# EAGLE design Bare Bones Arduino (EAGLE 6.5.0)
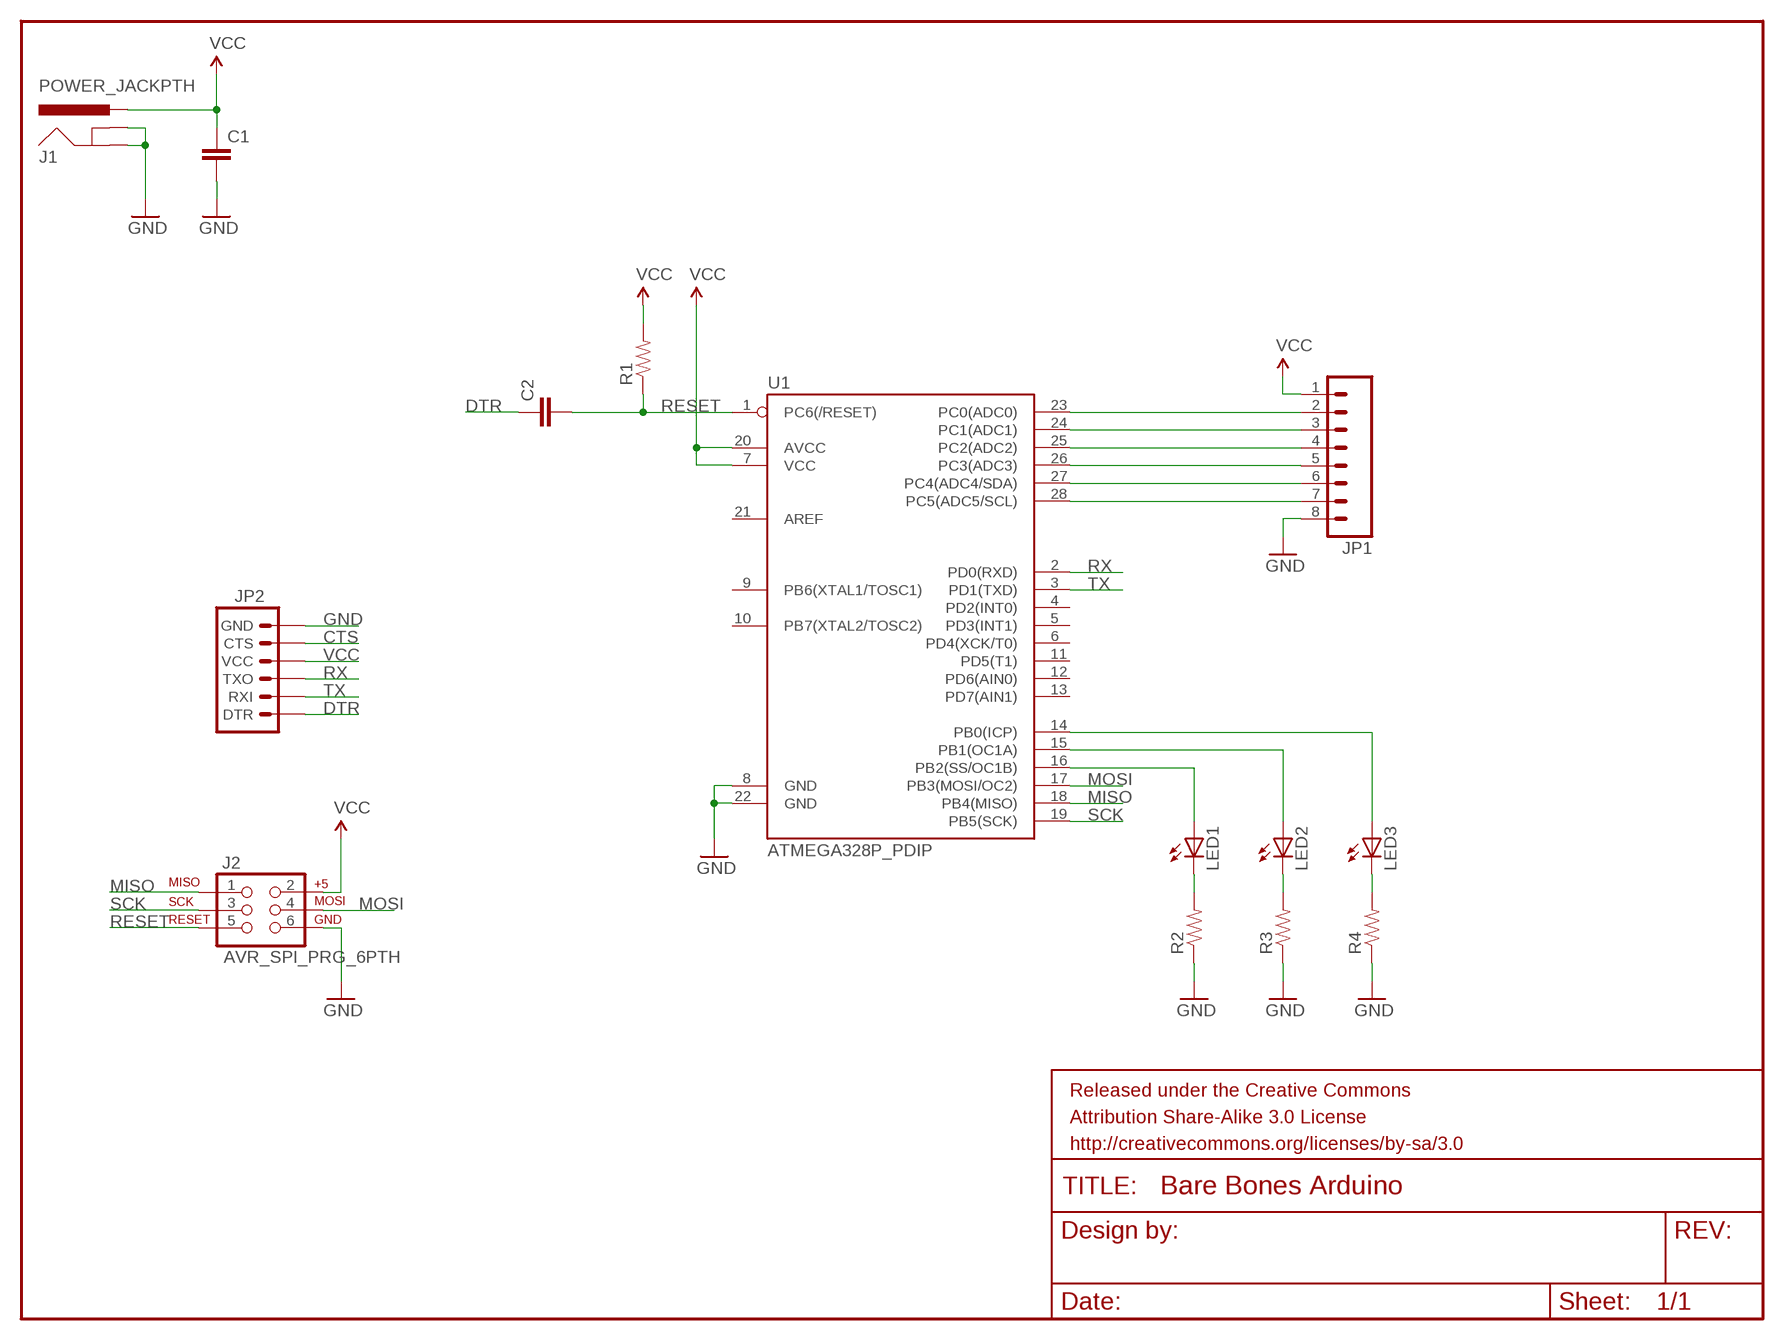
[diagram p0: schematic, sheet 1]

## Parts
C1  CAPPTH  [CAP-PTH-SMALL]
C2  CAPPTH  [CAP-PTH-SMALL]
FRAME1  FRAME-LETTER  [CREATIVE_COMMONS]
J1  POWER_JACKPTH  [POWER_JACK_PTH]
J2  AVR_SPI_PRG_6PTH  [2X3]
JP1  M081X08  [1X08]
JP2  ARDUINO_SERIAL_PROGRAMPTH  [1X06]
LED1  LED5MM  [LED5MM]
LED2  LED5MM  [LED5MM]
LED3  LED5MM  [LED5MM]
R1  RESISTORPTH-1/4W  [AXIAL-0.4]
R2  RESISTORPTH-1/4W  [AXIAL-0.4]
R3  RESISTORPTH-1/4W  [AXIAL-0.4]
R4  RESISTORPTH-1/4W  [AXIAL-0.4]
U1  ATMEGA328P_PDIP  [DIL28-3]

## Nets
CTS: JP2.5(CTS)
DTR: C2.1 JP2.1(DTR)
GND: C1.2 J1.GND J1.GNDBREAK J2.6 JP1.8 JP2.6(GND) R2.P$1 R3.P$1 R4.P$1 U1.8(GND) U1.22(GND)
MISO: J2.1 U1.18(PB4(MISO))
MOSI: J2.4 U1.17(PB3(MOSI/OC2))
N$1: LED1.A U1.16(PB2(SS/OC1B))
N$2: LED2.A U1.15(PB1(OC1A))
N$3: LED3.A U1.14(PB0(ICP))
N$4: LED1.K(C) R2.P$2
N$5: LED2.K(C) R3.P$2
N$6: LED3.K(C) R4.P$2
N$7: JP1.2 U1.23(PC0(ADC0))
N$8: JP1.3 U1.24(PC1(ADC1))
N$9: JP1.4 U1.25(PC2(ADC2))
N$10: JP1.5 U1.26(PC3(ADC3))
N$11: JP1.6 U1.27(PC4(ADC4/SDA))
N$12: JP1.7 U1.28(PC5(ADC5/SCL))
RESET: C2.2 J2.5 R1.P$1 U1.1(PC6(/RESET))
RX: JP2.3(TXO) U1.2(PD0(RXD))
SCK: J2.3 U1.19(PB5(SCK))
TX: JP2.2(RXI) U1.3(PD1(TXD))
VCC: C1.1 J1.PWR J2.2 JP1.1 JP2.4(VCC) R1.P$2 U1.7(VCC) U1.20(AVCC)
Unconnected: U1.4(PD2(INT0)) U1.5(PD3(INT1)) U1.6(PD4(XCK/T0)) U1.9(PB6(XTAL1/TOSC1)) U1.10(PB7(XTAL2/TOSC2)) U1.11(PD5(T1)) U1.12(PD6(AIN0)) U1.13(PD7(AIN1)) U1.21(AREF)

## Library data of the parts
C1 C2 = SparkFun-Capacitors:CAP: Capacitor Standard 0603 ceramic capacitor, and 0.1" leaded capacitor.
FRAME1 = SparkFun-Aesthetics:FRAME-LETTER: Schematic Frame Standard 8.5x11 US Letter frame
J1 = SparkFun-Connectors:POWER_JACK: Power Jack This is the standard 5.5mm barrel jack for power. The PTH is the most common, proven, reliable, footprint. The Slot footprint only works if the mill layer is transmitted to the PCB fab house so be warned. Spark Fun Electronics SKU : PRT-00119 SMT: CONN-08106 Mating wall wart : TOL-00298 (and others)
J2 = SparkFun-Connectors:AVR_SPI_PRG_6: AVR ISP 6 Pin This is the reduced ISP connector for AVR programming. Common on Arduino. This footprint will take up less PCB space and can be used with a 10-pin to 6-pin adapter such as SKU: BOB-08508
JP1 = SparkFun-Connectors:M08: Header 8 Standard 8-pin 0.1" header. Use with straight break away headers (SKU : PRT-00116), right angle break away headers (PRT-00553), swiss pins (PRT-00743), machine pins (PRT-00117), and female headers (PRT-00115).
JP2 = SparkFun-Connectors:ARDUINO_SERIAL_PROGRAM: FTDI connector footprints
LED1-LED3 = SparkFun-LED:LED: LEDs Standard schematic elements and footprints for 5mm, 3mm, 1206, and 0603 sized LEDs. 5mm - Spark Fun Electronics SKU : COM-00529 (and others)
R1-R4 = SparkFun-Resistors:RESISTOR: Resistor Basic schematic elements and footprints for 0603, 1206, and PTH resistors.
U1 = SparkFun-DigitalIC:ATMEGA328P_PDIP: uC used in the Arduino 32kb flash, 1k EEPROM, 2k SRAM This is the through-hole version of this chip.

## Board
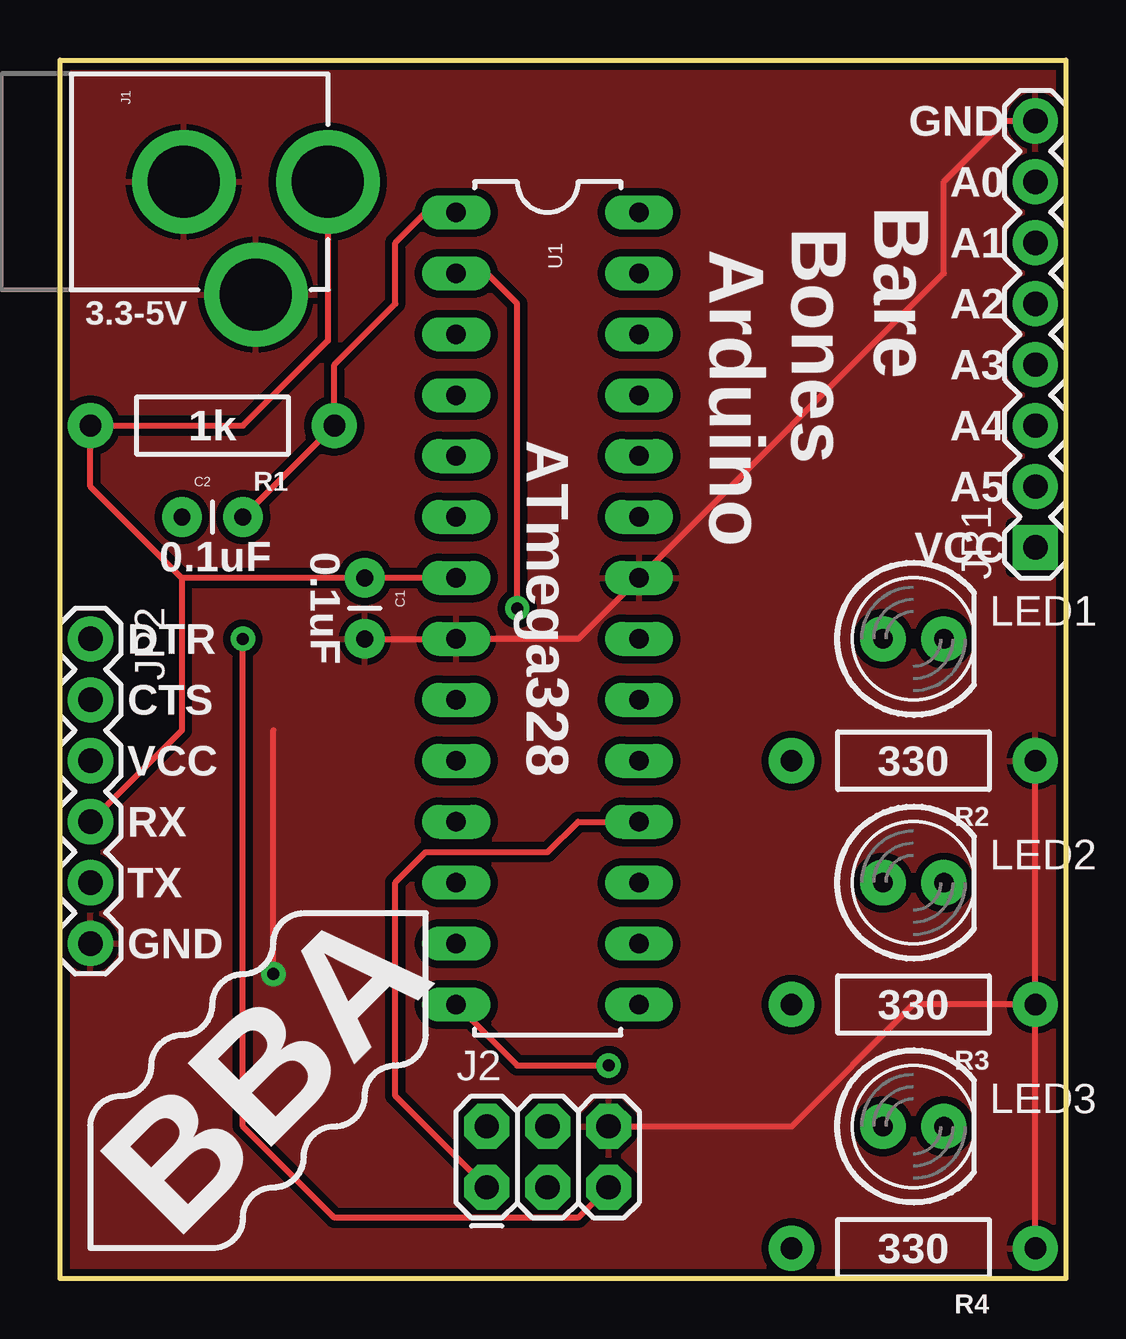
[diagram p1: board, top side]
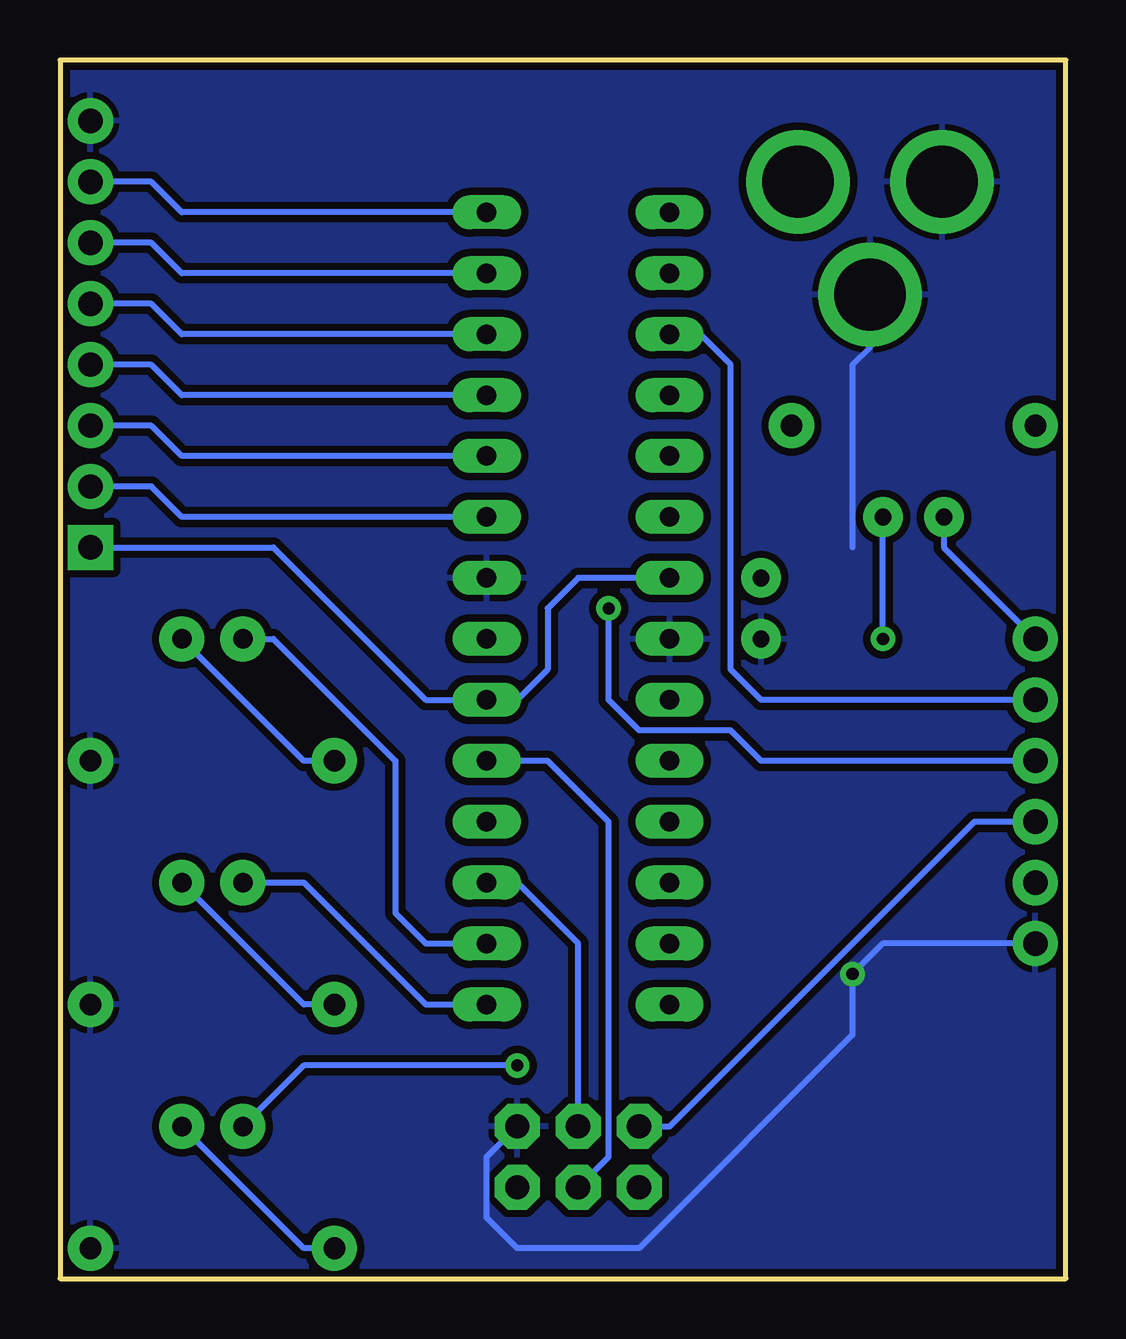
[diagram p2: board, bottom side, seen from below]

Size 41.91 x 50.8 mm. Coordinates in mm from the lower left corner, seen from the top.
Outline: 0,0 0,50.8 41.91,50.8 41.91,0 0,0
Copper layers (1*16): Top 0.035mm / dielectric 1.5mm / Bottom 0.035mm
Design rules "SparkFun": minimum track width 8mil, minimum drill 20mil, track to track 8mil, track to pad 8mil, pad to pad 8mil, via to via 8mil, smd to smd 8mil, copper to edge 8mil, drill to drill 8mil, minimum pad ring 12mil, minimum via ring 10mil, stop-mask expansion 4mil, vias tented up to drill 20mil, thermal gap 10mil

### Footprints (pad centres in the part's own frame; a part is rotated, then mirrored left to right if it is on the bottom)
CAP-PTH-SMALL = drill 0.7 pad 1.651: 1 0,0; 2 2.54,0
POWER_JACK_PTH = drill 2.997 pad 4.318: GND 0,7.7; GNDBREAK 4.7,10.7; PWR 0,13.7
2X3 = drill 1.016 pad 1.88 octagon: 1 0,0; 2 0,2.54; 3 2.54,0; 4 2.54,2.54; 5 5.08,0; 6 5.08,2.54
1X08 = drill 1.016 pad 1.88 square: 1 0,0 | drill 1.016 pad 1.88: 2 2.54,0; 3 5.08,0; 4 7.62,0; 5 10.16,0; 6 12.7,0; 7 15.24,0; 8 17.78,0
1X06 = drill 1.016 pad 1.88: 1 0,0; 2 2.54,0; 3 5.08,0; 4 7.62,0; 5 10.16,0; 6 12.7,0
LED5MM = drill 0.813 pad 1.88: A -1.27,0; K 1.27,0
AXIAL-0.4 = drill 0.9 pad 1.88: P$1 -5.08,0; P$2 5.08,0
DIL28-3 = drill 0.813 long: 1 -16.51,-3.81; 2 -13.97,-3.81; 3 -11.43,-3.81; 4 -8.89,-3.81; 5 -6.35,-3.81; 6 -3.81,-3.81; 7 -1.27,-3.81; 8 1.27,-3.81; 9 3.81,-3.81; 10 6.35,-3.81; 11 8.89,-3.81; 12 11.43,-3.81; 13 13.97,-3.81; 14 16.51,-3.81; 15 16.51,3.81; 16 13.97,3.81; 17 11.43,3.81; 18 8.89,3.81; 19 6.35,3.81; 20 3.81,3.81; 21 1.27,3.81; 22 -1.27,3.81; 23 -3.81,3.81; 24 -6.35,3.81; 25 -8.89,3.81; 26 -11.43,3.81; 27 -13.97,3.81; 28 -16.51,3.81

### Placement (x,y rotation side)
C1  12.7,29.21 270 top
C2  5.08,31.75 0 top
FRAME1  0,-2.54 0 top
J1  -2.54,45.72 270 top
J2  17.78,3.81 0 top
JP1  40.64,30.48 90 top
JP2  1.27,26.67 270 top
LED1  35.56,26.67 0 top
LED2  35.56,16.51 0 top
LED3  35.56,6.35 0 top
R1  6.35,35.56 180 top
R2  35.56,21.59 180 top
R3  35.56,11.43 180 top
R4  35.56,1.27 180 top
U1  20.32,27.94 270 top

### Tracks (layer width: path | path; a pad name or v marks a point on that pad's centre or on a via)
DTR
  Bottom 0.254: C2.1 5.08,30.48 JP2.1
GND  (via drill 0.51)
  Top 0.254: C1.2 U1.8 21.59,26.67 U1.22 36.83,41.91 36.83,45.72 39.37,48.26 JP1.8 | R3.P$1 35.56,11.43 30.48,6.35 J2.6 | R4.P$1 R3.P$1 | R3.P$1 R2.P$1 | v8.89,12.7 8.89,22.86 | J1.GND 5.16,44.02
  Bottom 0.254: J1.GNDBREAK 8.16,38.83 8.89,38.1 8.89,30.48 | JP2.6 7.62,13.97 v8.89,12.7 8.89,10.16 17.78,1.27 22.86,1.27 24.13,2.54 24.13,5.08 J2.6
  pour Top (isolate 0.305): 0,0 0,50.8 41.91,50.8 41.91,0
  pour Bottom (isolate 0.305): 0,50.8 0,0 41.91,0 41.91,50.8
MISO
  Top 0.254: J2.1 13.97,7.62 13.97,16.51 15.24,17.78 20.32,17.78 21.59,19.05 U1.18
MOSI
  Bottom 0.254: J2.4 20.32,13.97 22.86,16.51 U1.17
N$1
  Bottom 0.254: LED1.A 33.02,26.67 27.94,21.59 27.94,15.24 26.67,13.97 U1.16
N$2
  Bottom 0.254: LED2.A 31.75,16.51 26.67,11.43 U1.15
N$3  (via drill 0.51)
  Top 0.254: U1.14 19.05,8.89 v22.86,8.89
  Bottom 0.254: LED3.A 31.75,8.89 v22.86,8.89
N$4
  Bottom 0.254: R2.P$2 31.75,21.59 LED1.K
N$5
  Bottom 0.254: R3.P$2 31.75,11.43 LED2.K
N$6
  Bottom 0.254: R4.P$2 31.75,1.27 LED3.K
N$7
  Bottom 0.254: U1.23 36.83,31.75 38.1,33.02 JP1.2
N$8
  Bottom 0.254: U1.24 36.83,34.29 38.1,35.56 JP1.3
N$9
  Bottom 0.254: U1.25 36.83,36.83 38.1,38.1 JP1.4
N$10
  Bottom 0.254: U1.26 36.83,39.37 38.1,40.64 JP1.5
N$11
  Bottom 0.254: U1.27 36.83,41.91 38.1,43.18 JP1.6
N$12
  Bottom 0.254: U1.28 36.83,44.45 38.1,45.72 JP1.7
RESET  (via drill 0.51)
  Top 0.254: C2.2 R1.P$1 11.43,38.1 13.97,40.64 13.97,43.18 15.24,44.45 U1.1 | J2.5 21.59,2.54 11.43,2.54 7.62,6.35 v7.62,26.67
  Bottom 0.254: v7.62,26.67 C2.2
RX  (via drill 0.51)
  Top 0.254: v19.05,27.94 19.05,40.64 17.78,41.91 U1.2
  Bottom 0.254: JP2.3 12.7,21.59 13.97,22.86 17.78,22.86 19.05,24.13 v19.05,27.94
SCK
  Bottom 0.254: J2.3 19.05,5.08 19.05,19.05 21.59,21.59 U1.19
TX
  Bottom 0.254: JP2.2 12.7,24.13 13.97,25.4 13.97,38.1 15.24,39.37 U1.3
VCC
  Top 0.254: 5.08,29.21 C1.1 U1.7 | J1.PWR 11.16,39.1 7.62,35.56 R1.P$2 1.27,33.02 5.08,29.21 | 5.08,29.21 5.08,22.86 JP2.4
  Bottom 0.254: JP1.1 33.02,30.48 26.67,24.13 U1.20 22.86,24.13 21.59,25.4 21.59,27.94 20.32,29.21 U1.7 | J2.2 16.51,6.35 3.81,19.05 JP2.4

### Text on the board
tPlace: GND | A0 | Bare / Bones / Arduino | A1 | A2 | 3.3-5V | A3 | 1k | A4 | A5 | 0.1uF | VCC | 0.1uF | ATmega328 | DTR | CTS | VCC | 330 | RX | TX | GND | 330 | BBA | 330